# Altium schematic sheet TRISECT_Main.SchDoc
size A; SheetNumber: 1; SheetTotal: 2
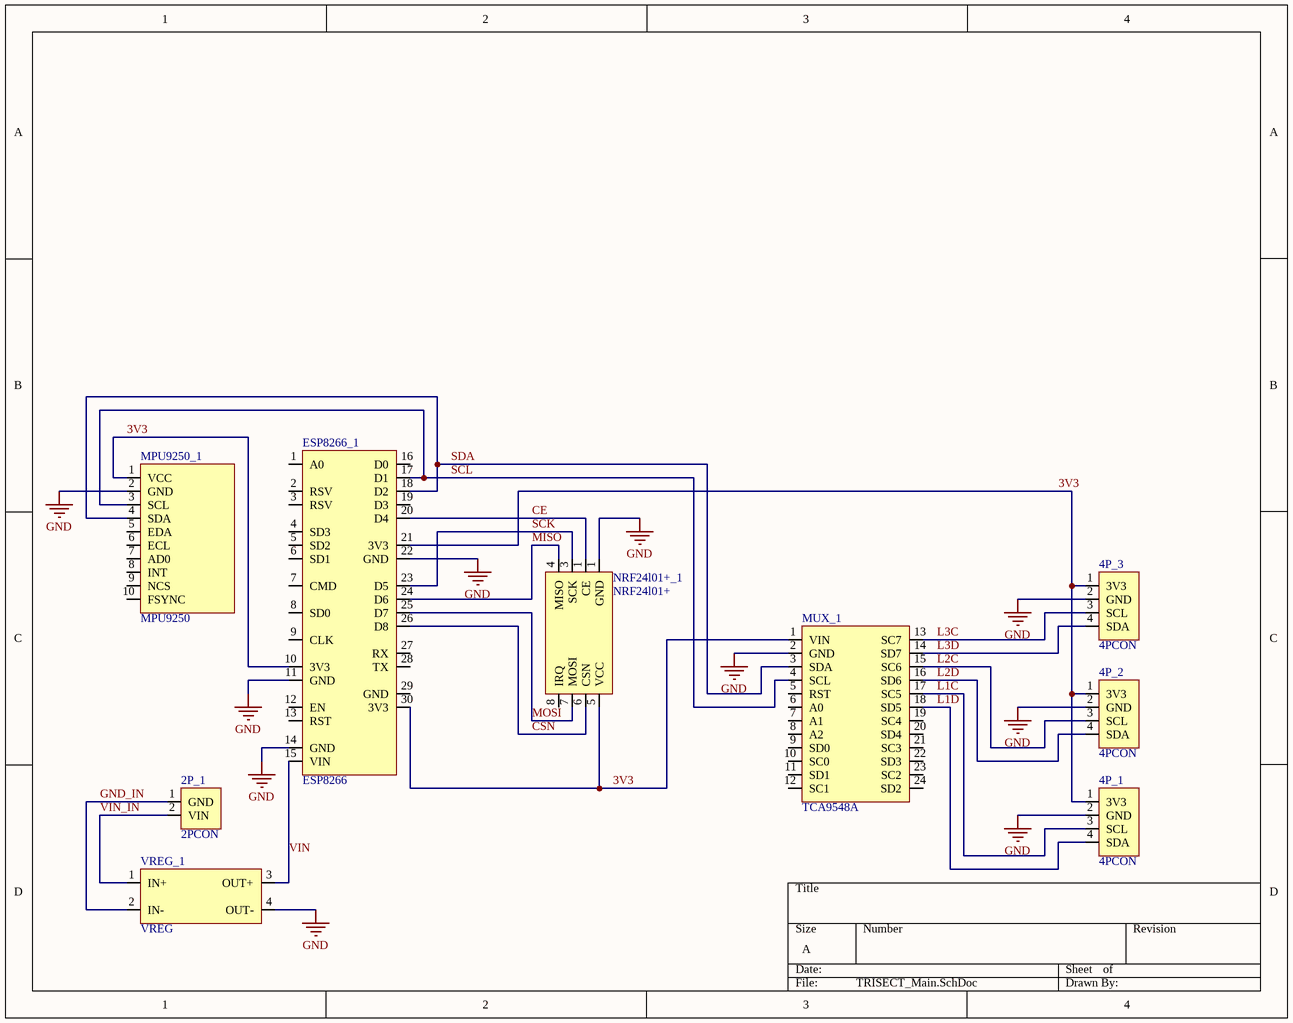
[diagram p0: TRISECT_Main.SchDoc]

## Parts
2P_1  2PCON  [2PCON]
4P_1  4PCON  [4PCON]
4P_2  4PCON  [4PCON]
4P_3  4PCON  [4PCON]
ESP8266_1  ESP8266  [ESP8266]
MPU9250_1  MPU9250  [MPU9250]
MUX_1  TCA9548A  [TCA9548A]
NRF24l01+_1  NRF24l01+  [NRF24l01+]
VREG_1  VREG  [VREG]

## Nets
GND: 4P_1.2(GND) 4P_2.2(GND) 4P_3.2(GND) ESP8266_1.11(GND) ESP8266_1.14(GND) ESP8266_1.22(GND) MPU9250_1.2(GND) MUX_1.2(GND) NRF24l01+_1.1(GND) VREG_1.4(OUT-)
3V3: 4P_1.1(3V3) 4P_2.1(3V3) 4P_3.1(3V3) ESP8266_1.10(3V3) ESP8266_1.21(3V3) ESP8266_1.30(3V3) MPU9250_1.1(VCC) MUX_1.1(VIN) NRF24l01+_1.5(VCC)
CE: ESP8266_1.20(D4) NRF24l01+_1.1(CE)
CSN: ESP8266_1.26(D8) NRF24l01+_1.6(CSN)
GND_IN: 2P_1.1(GND) VREG_1.2(IN-)
L1C: 4P_1.3(SCL) MUX_1.17(SC5)
L1D: 4P_1.4(SDA) MUX_1.18(SD5)
L2C: 4P_2.3(SCL) MUX_1.15(SC6)
L2D: 4P_2.4(SDA) MUX_1.16(SD6)
L3C: 4P_3.3(SCL) MUX_1.13(SC7)
L3D: 4P_3.4(SDA) MUX_1.14(SD7)
MISO: ESP8266_1.24(D6) NRF24l01+_1.4(MISO)
MOSI: ESP8266_1.25(D7) NRF24l01+_1.7(MOSI)
SCK: ESP8266_1.23(D5) NRF24l01+_1.3(SCK)
SCL: ESP8266_1.17(D1) MPU9250_1.3(SCL) MUX_1.4(SCL)
SDA: ESP8266_1.18(D2) MPU9250_1.4(SDA) MUX_1.3(SDA)
VIN: ESP8266_1.15(VIN) VREG_1.3(OUT+)
VIN_IN: 2P_1.2(VIN) VREG_1.1(IN+)

Not connected (* = marked no-connect by the designer): ESP8266_1 1(A0) 2(RSV) 3(RSV) 4(SD3) 5(SD2) 6(SD1) 7(CMD) 8(SD0) 9(CLK) 12(EN) 13(RST) 16(D0) 19(D3) 27(RX) 28(TX) 29(GND); MPU9250_1 5(EDA) 6(ECL) 7(AD0) 8(INT) 9(NCS) 10(FSYNC); MUX_1 5(RST) 6(A0) 7(A1) 8(A2) 9(SD0) 10(SC0) 11(SD1) 12(SC1) 19(SC4) 20(SD4) 21(SC3) 22(SD3) 23(SC2) 24(SD2); NRF24l01+_1 8(IRQ)

## Library data of the parts
2P_1 = 2PCON: 2 pin connector
4P_1-4P_3 = 4PCON: 4 pin connector
ESP8266_1 = ESP8266: Basic pinout for ESP8266 (NodeMCU)
MPU9250_1 = MPU9250: MPU9250 basic pinout
MUX_1 = TCA9548A: TCA9548A multiplexer 1:8 basic pinout
NRF24l01+_1 = NRF24l01+: NRF24l01+ basic pinout
VREG_1 = VREG: Voltage Regulator - basic pinout